# EAGLE schematic XBEE Breakout (EAGLE 7.6.0)
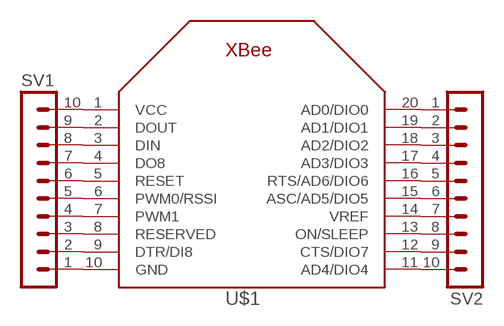
[diagram p0: schematic, sheet 1]

## Parts
SV1  MA10-1  [MA10-1]
SV2  MA10-1  [MA10-1]
U$1  XBEE  [XBEE]

## Nets
GND: SV1.1 U$1.10(GND)
N$1: SV1.2 U$1.9(DTR/DI8)
N$2: SV1.3 U$1.8(RESERVED)
N$3: SV1.4 U$1.7(PWM1)
N$4: SV1.5 U$1.6(PWM0/RSSI)
N$5: SV1.6 U$1.5(RESET)
N$6: SV1.7 U$1.4(DO8)
N$7: SV1.8 U$1.3(DIN)
N$8: SV1.9 U$1.2(DOUT)
N$9: SV2.1 U$1.20(AD0/DIO0)
N$10: SV2.2 U$1.19(AD1/DIO1)
N$11: SV2.3 U$1.18(AD2/DIO2)
N$12: SV2.4 U$1.17(AD3/DIO3)
N$13: SV2.5 U$1.16(RTS/AD6/DIO6)
N$14: SV2.6 U$1.15(ASC/AD5/DIO5)
N$16: SV2.7 U$1.14(VREF)
N$17: SV2.8 U$1.13(ON/SLEEP)
N$18: SV2.9 U$1.12(CTS/DIO7)
N$19: SV2.10 U$1.11(AD4/DIO4)
VCC: SV1.10 U$1.1(VCC)

## Library data of the parts
SV1 SV2 = con-lstb:MA10-1: PIN HEADER; OC_FARNELL: unknown; OC_NEWARK: unknown
U$1 = HyTechDevices:XBEE: Source: Adafruit <https://github.com/adafruit/Adafruit-Eagle-Library>